# EAGLE design ECG (EAGLE 7.5.0)

## Sheet 1 of 2
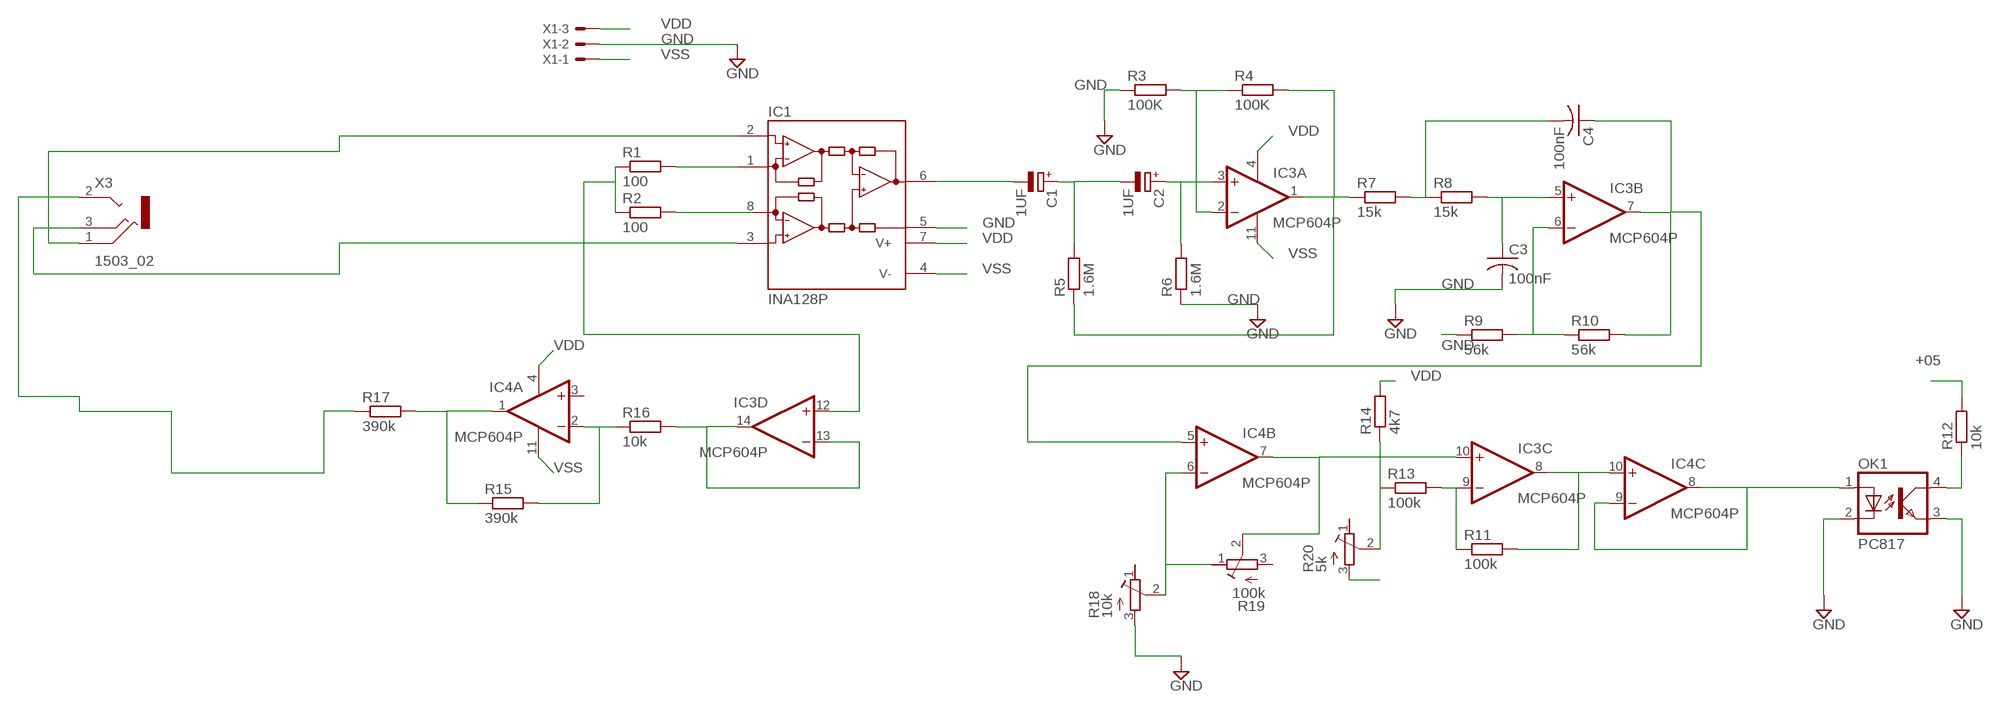
[diagram p0: schematic, sheet 1]

### Parts
C1  1UF  CPOL-EUE5-6  [E5-6]
C2  1UF  CPOL-EUE5-6  [E5-6]
C3  100nF  C-US050-030X075  [C050-030X075]
C4  100nF  C-US050-030X075  [C050-030X075]
IC1  INA128P  [DIL08]
IC3  MCP604P  [DIL14]
IC4  MCP604P  [DIL14]
OK1  PC817  [DIL04]
R1  100  R-EU_0207/10  [0207/10]
R2  100  R-EU_0207/10  [0207/10]
R3  100K  R-EU_0207/10  [0207/10]
R4  100K  R-EU_0207/10  [0207/10]
R5  1.6M  R-EU_0207/10  [0207/10]
R6  1.6M  R-EU_0207/10  [0207/10]
R7  15k  R-EU_0207/10  [0207/10]
R8  15k  R-EU_0207/10  [0207/10]
R9  56k  R-EU_0207/10  [0207/10]
R10  56k  R-EU_0207/10  [0207/10]
R11  100k  R-EU_0207/10  [0207/10]
R12  10k  R-EU_0207/10  [0207/10]
R13  100k  R-EU_0207/10  [0207/10]
R14  4k7  R-EU_0207/10  [0207/10]
R15  390k  R-EU_0207/10  [0207/10]
R16  10k  R-EU_0207/10  [0207/10]
R17  390k  R-EU_0207/10  [0207/10]
R18  10k  R-TRIMMT18  [RTRIMT18]
R19  100k  R-TRIMMT18  [RTRIMT18]
R20  5k  R-TRIMMT18  [RTRIMT18]
X1  KK-156-3  [KK-156-3]
X3  1503_02  [1503_02]

### Nets
+05: R12.2 ; also sheet 2
GND: C3.2 IC1.5(REF) OK1.2(C) OK1.3(EMIT) R3.1 R6.1 R9.1 R18.3(A) X1.2 ; also sheet 2
N$1: IC3.9(C:-IN) R11.1 R13.2
N$3: IC1.1(RG) R1.2
N$4: IC1.8(RG) R2.2
N$5: IC3.12(D:+IN) R1.1 R2.1
N$6: IC1.2(-IN) X3.1
N$7: IC3.13(D:-IN) IC3.14(D:OUT) R16.2
N$8: IC4.2(A:-IN) R15.2 R16.1
N$9: IC4.1(A:OUT) R15.1 R17.2
N$10: R17.1 X3.2
N$11: IC1.3(+IN) X3.3
N$12: C1.- IC1.6(OUT)
N$13: C1.+ C2.- R5.2
N$14: C2.+ IC3.3(A:+IN) R6.2
N$15: IC3.1(A:OUT) R4.2 R5.1 R7.1
N$16: C4.2 R7.2 R8.1
N$17: IC3.2(A:-IN) R3.2 R4.1
N$18: C3.1 IC3.5(B:+IN) R8.2
N$19: IC3.6(B:-IN) R9.2 R10.1
N$20: C4.1 IC3.7(B:OUT) IC4.5(B:+IN) R10.2
N$21: IC3.10(C:+IN) IC4.7(B:OUT) R19.2(S)
N$22: IC4.6(B:-IN) R18.2(S) R19.1(E)
N$23: R13.1 R14.1 R20.2(S)
N$24: IC3.8(C:OUT) IC4.10(C:+IN) R11.2
VDD: IC1.7(V+) IC3.4(P:V+) IC4.4(P:V+) R14.2 X1.3 ; also sheet 2
VECG: IC4.8(C:OUT) IC4.9(C:-IN) OK1.1(A) ; also sheet 2
VECG1: OK1.4(COL) R12.1 ; also sheet 2
VSS: IC1.4(V-) IC3.11(P:V-) IC4.11(P:V-) R20.3(A) X1.1
Unconnected: IC4.3(A:+IN) IC4.12(D:+IN) IC4.13(D:-IN) IC4.14(D:OUT) R18.1(E) R19.3(A) R20.1(E) X3.2@2

## Sheet 2 of 2
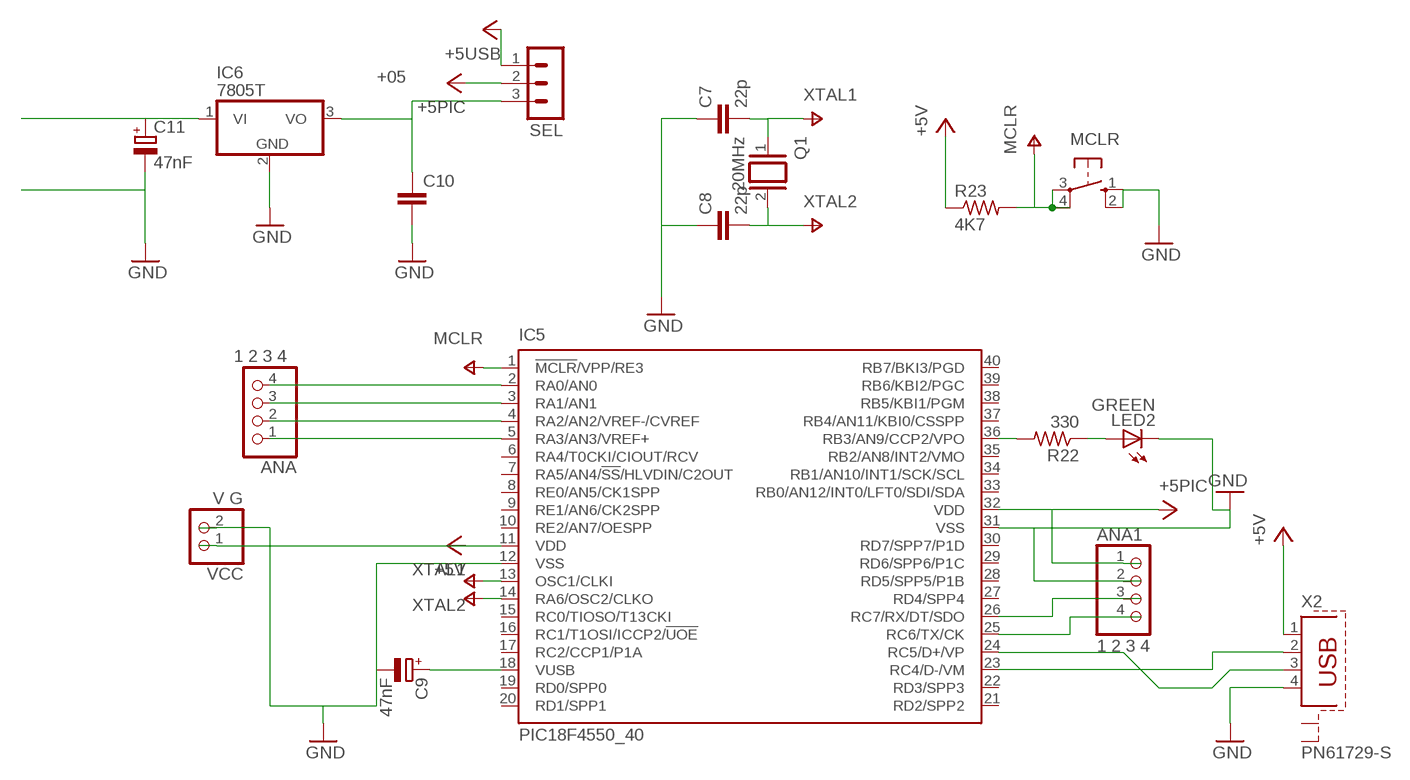
[diagram p1: schematic, sheet 2]

### Parts
ANA  1 2 3 4  PINHD-1X4  [1X04]
ANA1  1 2 3 4  PINHD-1X4  [1X04]
C7  22p  C-EU025-024X044  [C025-024X044]
C8  22p  C-EU025-024X044  [C025-024X044]
C9  47nF  CPOL-EUE2,5-6E  [E2,5-6E]
C10  C-EU050-035X075  [C050-035X075]
C11  47nF  CPOL-EUE2,5-6E  [E2,5-6E]
IC5  PIC18F4550_40  [DIL40]
IC6  7805T  [TO220H]
LED2  GREEN  TLLG4400  [LED3MM]
MCLR  10-XX  [B3F-10XX]
Q1  20MHz  XTAL/S  [QS]
R22  330  R-US_0207/10  [0207/10]
R23  4K7  R-US_0207/10  [0207/10]
SEL  MA03-1  [MA03-1]
VCC  V G  PINHD-1X2  [1X02]
X2  PN61729-S  [PN61729-S]

### Nets
+05: C10.1 IC6.3(VO) SEL.3 ; also sheet 1
+5PIC: ANA1.1 IC5.11(VDD) IC5.32(VDD) R23.1 SEL.2 VCC.1 ; supply symbol labelled +5V
+5USB: SEL.1 X2.1 ; supply symbol labelled +5V
GND: ANA1.2 C7.1 C8.1 C9.- C10.2 C11.- IC5.12(VSS) IC5.31(VSS) IC6.2(GND) LED2.K(C) MCLR.1(S) MCLR.2(S1) VCC.2 X2.4 ; also sheet 1
MCLR: IC5.1(!MCLR!/VPP/RE3) MCLR.3(P) MCLR.4(P1) R23.2
N$2: ANA1.3 IC5.26(RC7/RX/DT/SDO)
N$25: ANA1.4 IC5.25(RC6/TX/CK)
N$30: IC5.36(RB3/AN9/CCP2/VPO) R22.2
N$155: LED2.A R22.1
N$159: IC5.23(RC4/D-/VM) X2.2
N$168: IC5.24(RC5/D+/VP) X2.3
N$175: C9.+ IC5.18(VUSB)
N$180: ANA.2 IC5.4(RA2/AN2/VREF-/CVREF)
N$181: ANA.1 IC5.5(RA3/AN3/VREF+)
VDD: C11.+ IC6.1(VI) ; also sheet 1
VECG: ANA.4 IC5.2(RA0/AN0) ; also sheet 1
VECG1: ANA.3 IC5.3(RA1/AN1) ; also sheet 1
XTAL1: C7.2 IC5.13(OSC1/CLKI) Q1.1
XTAL2: C8.2 IC5.14(RA6/OSC2/CLKO) Q1.2
Unconnected: IC5.6(RA4/T0CKI/CIOUT/RCV) IC5.7(RA5/AN4/!SS!/HLVDIN/C2OUT) IC5.8(RE0/AN5/CK1SPP) IC5.9(RE1/AN6/CK2SPP) IC5.10(RE2/AN7/OESPP) IC5.15(RC0/TIOSO/T13CKI) IC5.16(RC1/T1OSI/ICCP2/!UOE) IC5.17(RC2/CCP1/P1A) IC5.19(RD0/SPP0) IC5.20(RD1/SPP1) IC5.21(RD2/SPP2) IC5.22(RD3/SPP3) IC5.27(RD4/SPP4) IC5.28(RD5/SPP5/P1B) IC5.29(RD6/SPP6/P1C) IC5.30(RD7/SPP7/P1D) IC5.33(RB0/AN12/INT0/LFT0/SDI/SDA) IC5.34(RB1/AN10/INT1/SCK/SCL) IC5.35(RB2/AN8/INT2/VMO) IC5.37(RB4/AN11/KBI0/CSSPP) IC5.38(RB5/KBI1/PGM) IC5.39(RB6/KBI2/PGC) IC5.40(RB7/BKI3/PGD) X2.S1 X2.S2

## Library data of the parts
ANA ANA1 = pinhead:PINHD-1X4: PIN HEADER
C1 C2 C9 C11 = resistor:CPOL-EU: POLARIZED CAPACITOR, European symbol
C3 C4 = resistor:C-US: CAPACITOR, American symbol
C7 C8 C10 = rcl:C-EU: CAPACITOR, European symbol
IC1 = burr-brown:INA128: Instrumentation Amplifiers Precision, Low Power; MF: TEXAS INSTRUMENTS; MPN: INA128P; OC_FARNELL: 1212410; OC_NEWARK: 74C9783
IC3 IC4 = linear:MCP604: Quad Op Amp 2.7V to 6.0V Single Supply CMOS Source: http://ww1.microchip.com/downloads/en/DeviceDoc/21314g.pdf
IC5 = microchip:PIC18F4*_40: USB Microcontrollers with nanoWatt Technology High-Performance, Enhanced Flash, 28/40/44-Pin, Source: http://ww1.microchip.com/downloads/en/devicedoc/39632c.pdf; MF: MICROCHIP; MPN: PIC18F4550-I/P; OC_FARNELL: 9321357; OC_NEWARK: 74K8623
IC6 = linear:78*: Positive VOLTAGE REGULATOR Source: http://cache.national.com/ds/LM/LM78L05.pdf http://www.fairchildsemi.com/ds/LM/LM7805.pdf
LED2 = led:TLLG4400: Low Current (2mA) LED 3 mm Tinted Diffused Package color GREEN Source: Data sheet <http://www.farnell.com/datasheets/391098.pdf>; MF: VISHAY SEMICONDUCTOR; OC_FARNELL: 1612435
MCLR = switch-omron:10-XX: OMRON SWITCH; MPN: B3F-1000; OC_FARNELL: 176432; OC_NEWARK: 36M3542
OK1 = optocoupler:PC817: SHARP OPTO COUPLER; MPN: PC817X4J000F; OC_FARNELL: 9707727; OC_NEWARK: 97K7059
Q1 = special:XTAL/S: CRYSTAL
R1-R17 = resistor:R-EU_: RESISTOR, European symbol
R18-R20 = rcl:R-TRIMM: Trimm resistor
R22 R23 = resistor:R-US_: RESISTOR, American symbol
SEL = con-lstb:MA03-1: PIN HEADER; OC_FARNELL: unknown; OC_NEWARK: unknown
VCC = pinhead:PINHD-1X2: PIN HEADER
X1 = con-molex:KK-156-3: KK 156 HEADER Source: http://www.molex.com/pdm_docs/sd/026604100_sd.pdf; OC_FARNELL: unknown; OC_NEWARK: unknown
X2 = con-berg:PN61729-S: BERG USB connector; OC_FARNELL: unknown; OC_NEWARK: unknown
X3 = con-lumberg:1503_02: Jack connectors according to JISC 6560, 3.5 mm Klinkeneinbaukupplung nach JISC 6560, 3,5 mm, 3-polig/stereo, abgewinkelte Ausführung, Surface-Mount-Technik (SMT) Source: http://www.lumberg.com/Produkte/PDFs/1503_02.pdf; OC_FARNELL: 1216979; OC_NEWARK: unknown

## Board
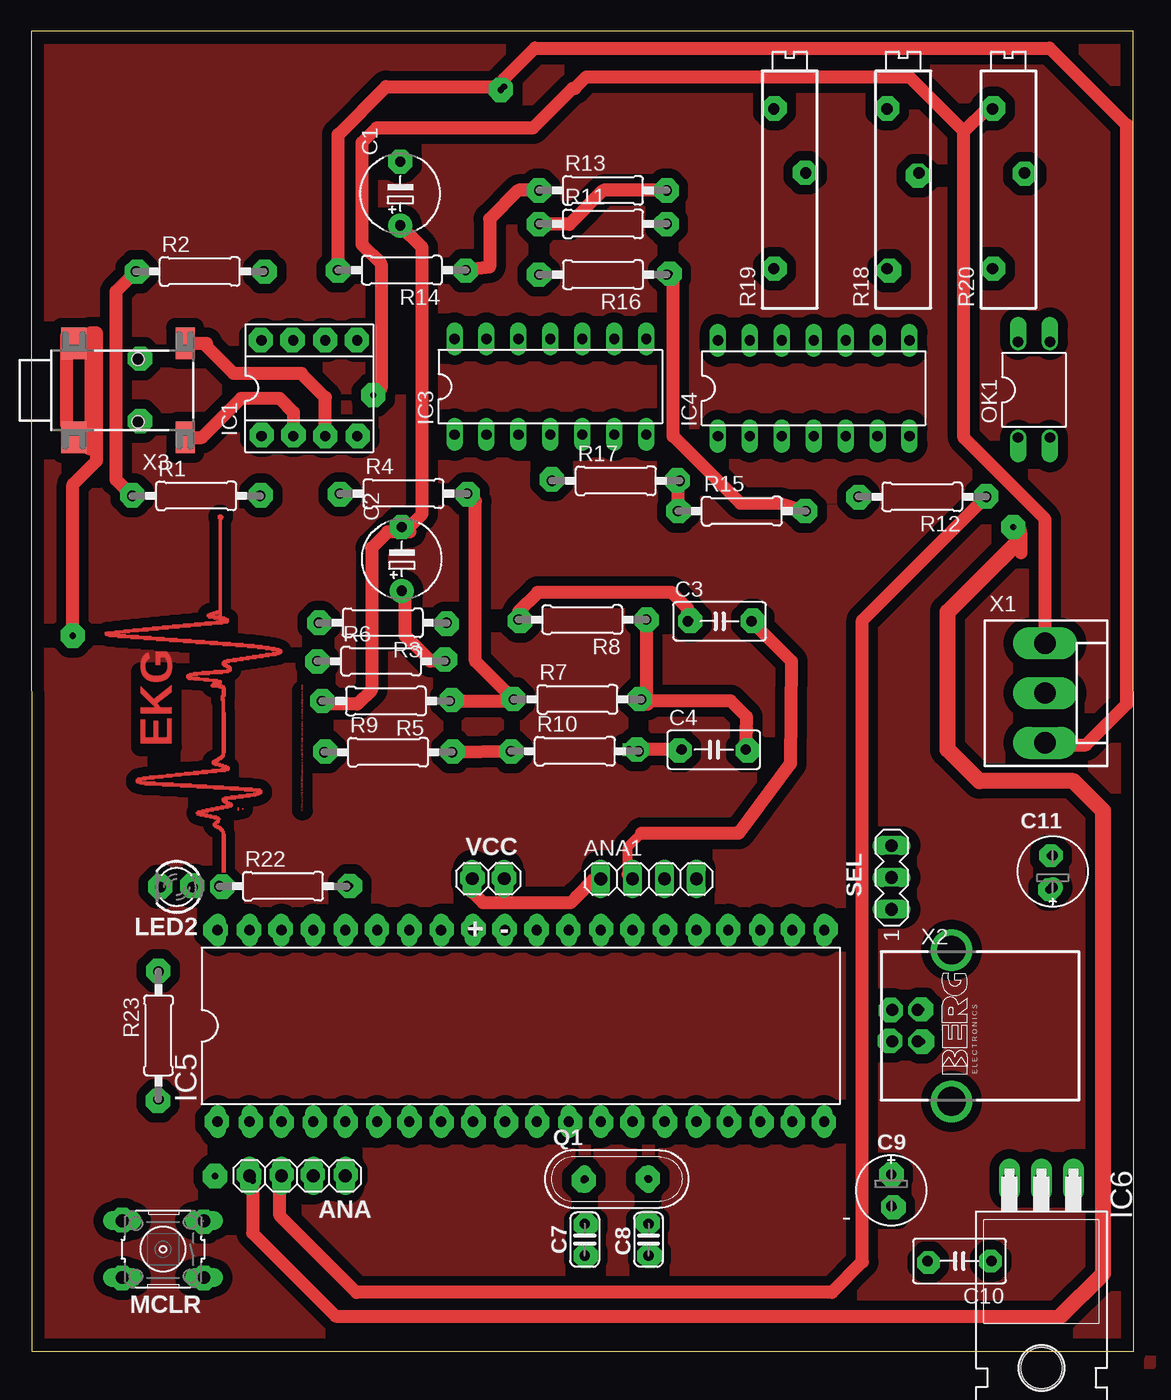
[diagram p2: board, top side]
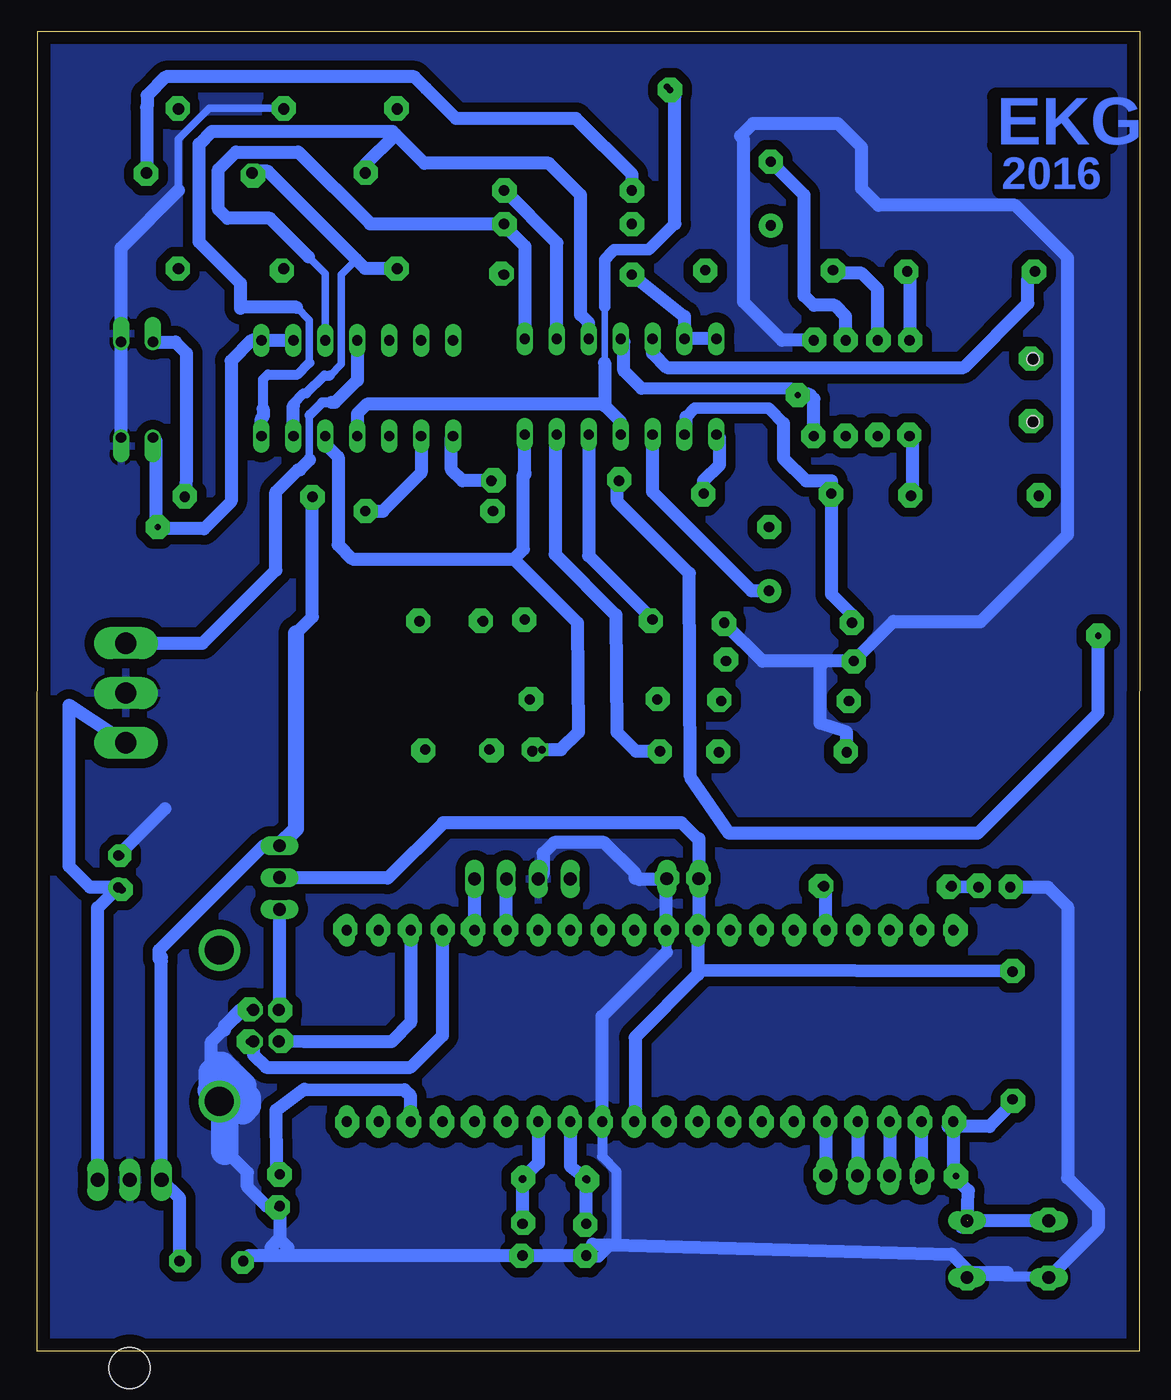
[diagram p3: board, bottom side, seen from below]

Size 87.69 x 105.05 mm. Coordinates in mm from the lower left corner, seen from the top.
Outline: 0.03,0 87.69,0 87.66,105.05 0,105.05 0.03,0
Copper layers (1*16): Top 0.035mm / dielectric 1.5mm / Bottom 0.035mm
Design rules "default *": minimum track width 10mil, minimum drill 24mil, track to track 30mil, track to pad 30mil, pad to pad 30mil, via to via 30mil, smd to smd 8mil, copper to edge 40mil, drill to drill 8mil, minimum pad ring 10mil, minimum via ring 8mil, stop-mask expansion 4mil, vias tented up to drill 0mil, thermal gap 10mil

### Footprints (pad centres in the part's own frame; a part is rotated, then mirrored left to right if it is on the bottom)
1X04 = drill 1.016 long: 1 -3.81,0; 2 -1.27,0; 3 1.27,0; 4 3.81,0
E5-6 = drill 0.813 pad 1.905: + -2.54,0 | drill 0.813 pad 1.905 octagon: - 2.54,0
C050-030X075 = drill 0.813 octagon: 1 -2.54,0; 2 2.54,0
C025-024X044 = drill 0.813 octagon: 1 -1.27,0; 2 1.27,0
E2,5-6E = drill 0.813 pad 1.575: + -1.27,0 | drill 0.813 pad 1.575 octagon: - 1.27,0
C050-035X075 = drill 0.813 octagon: 1 -2.54,0; 2 2.54,0
DIL08 = drill 0.813 pad 1.6 octagon: 1 -3.81,-3.81; 2 -1.27,-3.81; 3 1.27,-3.81; 4 3.81,-3.81; 5 3.81,3.81; 6 1.27,3.81; 7 -1.27,3.81; 8 -3.81,3.81
DIL14 = drill 0.813 long: 1 -7.62,-3.81; 2 -5.08,-3.81; 3 -2.54,-3.81; 4 0,-3.81; 5 2.54,-3.81; 6 5.08,-3.81; 7 7.62,-3.81; 8 7.62,3.81; 9 5.08,3.81; 10 2.54,3.81; 11 0,3.81; 12 -2.54,3.81; 13 -5.08,3.81; 14 -7.62,3.81
DIL40 = drill 0.813 long: 1 -24.13,-7.62; 2 -21.59,-7.62; 3 -19.05,-7.62; 4 -16.51,-7.62; 5 -13.97,-7.62; 6 -11.43,-7.62; 7 -8.89,-7.62; 8 -6.35,-7.62; 9 -3.81,-7.62; 10 -1.27,-7.62; 11 1.27,-7.62; 12 3.81,-7.62; 13 6.35,-7.62; 14 8.89,-7.62; 15 11.43,-7.62; 16 13.97,-7.62; 17 16.51,-7.62; 18 19.05,-7.62; 19 21.59,-7.62; 20 24.13,-7.62; 21 24.13,7.62; 22 21.59,7.62; 23 19.05,7.62; 24 16.51,7.62; 25 13.97,7.62; 26 11.43,7.62; 27 8.89,7.62; 28 6.35,7.62; 29 3.81,7.62; 30 1.27,7.62; 31 -1.27,7.62; 32 -3.81,7.62; 33 -6.35,7.62; 34 -8.89,7.62; 35 -11.43,7.62; 36 -13.97,7.62; 37 -16.51,7.62; 38 -19.05,7.62; 39 -21.59,7.62; 40 -24.13,7.62
TO220H = drill 1.118 long: 1 -2.54,-10.16; 2 0,-10.16; 3 2.54,-10.16 | hole 3.302: 0,4.826
LED3MM = drill 0.813 octagon: A -1.27,0; K 1.27,0
B3F-10XX = drill 1.016 long: 1 -3.251,2.261; 2 3.251,2.261; 3 -3.251,-2.261; 4 3.251,-2.261
DIL04 = drill 0.813 offset: 1 -1.27,-3.81; 2 1.27,-3.81; 3 1.27,3.81; 4 -1.27,3.81
QS = drill 0.61 long: 1 -2.54,0; 2 2.54,0
0207/10 = drill 0.813 octagon: 1 -5.08,0; 2 5.08,0
RTRIMT18 = drill 0.9: 1 -7.62,1.27; 2 0,-1.27; 3 5.08,1.27
MA03-1 = drill 1.016 long: 1 -2.54,0; 2 0,0; 3 2.54,0
1X02 = drill 1.016 long: 1 -1.27,0; 2 1.27,0
KK-156-3 = drill 1.7 pad 2.184 long: 1 -3.96,0; 2 0,0; 3 3.96,0
PN61729-S = drill 0.95 octagon: 1 1.25,4.71; 2 -1.25,4.71; 3 -1.25,2.71; 4 1.25,2.71 | drill 2.3 pad 2.9: S1 -6.02,0; S2 6.02,0
1503_02 = smd 2.5 x 1.5: 1 -3.75,-10.75; 3 3.75,-10.75 | smd 2.5 x 2: 2 -3.75,-1.9; 2@2 3.75,-1.9 | hole 1: -2.5,-7; 2.5,-7

### Placement (x,y rotation side)
ANA  21.16,13.97 180 top
ANA1  49.1,37.59 0 top
C1  29.35,92.15 90 top
C2  29.47,63.06 90 top
C3  54.75,58.11 0 top
C4  54.29,47.89 0 top
C7  44.02,8.89 90 top
C8  49.1,8.89 90 top
C9  68.4,12.83 270 top
C10  73.84,7.19 180 top
C11  81.26,38.2 90 top
IC1  22.11,76.65 0 top
IC3  41.29,76.78 0 top
IC4  62.24,76.65 0 top
IC5  38.94,25.91 0 top
IC6  80.36,3.49 180 top
LED2  11.55,36.95 180 top
MCLR  10.47,8.13 180 top
OK1  79.77,76.53 0 top
Q1  46.56,13.72 0 top
R1  13.11,68.09 0 top
R2  13.39,85.94 0 top
R3  27.95,57.98 180 top
R4  29.6,68.27 0 top
R5  28.2,51.76 180 top
R6  27.82,54.94 0 top
R7  43.44,51.89 0 top
R8  43.83,58.24 180 top
R9  28.38,47.69 0 top
R10  43.24,47.76 0 top
R11  45.48,89.73 0 top
R12  70.88,68.02 180 top
R13  45.48,92.4 0 top
R14  29.47,86.05 180 top
R15  56.53,66.87 0 top
R16  45.48,85.69 180 top
R17  46.49,69.29 0 top
R18  69.35,93.8 90 top
R19  60.34,93.8 90 top
R20  77.73,93.8 90 top
R22  20.02,37.01 0 top
R23  10.11,25.15 270 top
SEL  68.43,37.71 90 top
VCC  36.34,37.62 0 top
X1  80.66,52.4 270 top
X2  73.21,25.91 90 top
X3  1.48,76.48 90 top

### Tracks (layer width: path | path; a pad name or v marks a point on that pad's centre or on a via)
+05  (via drill 0.5 pad 1.93)
  Bottom 1.016: 77.82,31.05 IC6.3 76.38,12.22 C10.1 | 77.82,31.05 77.82,31.36 | 67.09,57.16 65.81,58.45 v65.81,67.98 65.81,68 R12.2 | SEL.3 69.68,40.25 78.01,31.91 78.01,31.25 77.82,31.05
  Bottom 1.27: SEL.3 67.09,41.59 67.09,57.16
+5PIC
  Top 1.016: ANA1.1 44.79,37.59 43.37,36.17 | 43.37,36.17 | 43.37,36.17 42.9,35.7 35.93,35.7 35.07,36.56 VCC.1
  Bottom 1.016: 35.13,30.42 IC5.32 35.07,33.59 VCC.1 35.05,37.63 35.05,40.79 35.16,40.79 36.44,42.07 55.41,42.07 59.82,37.66 68.38,37.66 SEL.2 | 35.13,30.42 35.13,30 40.14,24.99 40.14,18.36 IC5.11 | R23.1 35.02,30.3 35.13,30.42
+5USB
  Bottom 1.016: SEL.1 68.43,27.22 X2.1
GND
  Top 0.813: 47.45,37.97 47.45,40.14 48.52,41.22
  Top 1.016: 47.45,37.97 ANA1.2 | C3.2 60.46,54.94 60.38,46.75 56.27,41.22 48.52,41.22
  Bottom 0.61: 76.46,92.4 76.46,96.46 74,98.92 68.13,98.92 R18.3
  Bottom 0.813: IC5.12 42.75,15.5 41.63,14.38 41.63,8.84 43.02,7.45 43.85,7.45 C7.1 | 37.63,31.79 37.63,33.49 IC5.31 | 10.79,5.99 10.42,6.35 13.5,6.35 13.87,5.99 13.6,5.99 | 10.79,5.99 13.21,5.99 13.6,5.99 | 13.6,5.99 MCLR.1 | 10.79,5.99 7.34,5.99 MCLR.2
  Bottom 1.016: X2.4 71.55,27.16 | 71.55,27.16 72.8,25.91 | 68.7,7.62 C8.1 C7.1 43.51,8.52 14.95,7.73 13.21,5.99 | 68.7,7.62 70.87,7.62 C10.2 | 68.35,8.87 68.4,8.91 C9.- 69.45,11.56 70.98,13.09 70.98,14.24 72.62,15.88 72.7,15.88 | 67.74,8.25 68.35,8.87 | 68.35,8.87 68.51,8.87 69.12,8.25 69.12,8.04 68.7,7.62 | 71.55,27.16 71.55,27.08 72.77,25.86 | 73.84,20.79 73.84,24.64 72.81,25.67 | 72.81,25.67 72.81,25.74 71.36,27.19 | 72.81,25.55 72.81,25.67 | 71.36,27.19 71.17,27.38 70.79,27.38 70.6,27.19 71.36,27.19 | 72.7,15.88 72.77,15.88 72.89,15.99 72.81,15.99 72.7,15.88 | IC5.31 37.67,37.56 | 37.67,37.56 VCC.2 | 77.55,43.18 C11.- | IC1.5 28.46,80.46 31.51,83.51 31.51,96.46 31.76,96.72 30.74,97.73 24.01,97.73 22.11,95.83 22.11,92.55 20.77,91.21 9.9,91.21 5.72,87.03 5.72,64.99 12.66,58.06 19.62,58.06 | 19.57,58.11 19.62,58.06 | 19.62,58.06 R6.1 25.03,54.94 | 25.03,54.94 29.98,54.94 R3.1 | R9.1 23.3,49.29 25.41,49.98 25.41,54.55 25.03,54.94 | OK1.2 OK1.3 81.04,87.83 76.46,92.4 | IC5.12 42.75,26.67 37.63,31.79 | LED2.K 7.3,36.95 5.73,35.38 5.73,13.8 3.29,11.36 3.29,9.8 MCLR.2 | 37.67,37.56 39.8,37.56 39.9,37.66 40.14,37.66 40.14,38.06 42.58,40.5 46.58,40.5 47.45,39.63 47.45,37.97 ANA1.2
  Bottom 2.184: 72.77,15.93 72.77,20.41 71.74,21.44 71.74,20.94 70.98,20.18 70.98,19.53 71.36,19.15 71.36,21.13 73,22.77 73.19,22.77 73.76,22.2 73.76,20.87 73.84,20.79
  pour Bottom: -0.53,105.32 -0.61,-0.8 89.27,-0.77 89.35,105.34
MCLR  (1 unrouted)
  Bottom 1.016: 14.81,17.74 IC5.1 14.56,18.03 | 14.81,17.74 14.81,13.97 13.62,12.78 MCLR.3 | MCLR.4 13.66,10.39 14.17,9.88 | R23.2 10.11,19.74 11.95,17.9 14.97,17.9 | 15.26,17.9 14.97,17.9 | 14.97,17.9 14.81,17.74
N$1
  Top 1.016: R13.2 45.51,92.4 42.82,89.71 40.42,89.71 R11.1
  Bottom 1.016: IC3.9 46.36,88.21 R13.2
N$2
  Bottom 1.016: IC5.26 ANA1.3
N$3
  Bottom 1.016: IC1.1 18.42,72.72 18.32,72.72 18.09,72.94 18.09,68.18 R1.2
N$4
  Bottom 1.016: R2.2 18.3,85.69 IC1.8
N$5
  Top 1.016: R2.1 6.74,84.37 6.74,69.38 R1.1
  Bottom 1.016: IC3.12 38.74,79.45 37.6,78.3 13.99,78.3 8.88,83.41 8.88,85.38 R2.1
N$6
  Top 1.016: X3.1 13.55,72.73 16.67,75.85 19.75,75.85 20.85,74.75 20.85,72.85 IC1.2
N$7
  Bottom 1.016: IC3.13 36.2,81.48 | IC3.14 IC3.13 | R16.2 36.2,82.37 IC3.13
N$8
  Top 1.016: R15.2 59.57,67.51 56.4,67.51 51.06,72.84 51.06,85.04 50.57,85.61 R16.1
  Bottom 1.016: IC4.2 57.16,69.92 60.21,66.87 R15.2
N$9
  Top 1.016: R15.1 51.44,69.03 R17.2
  Bottom 1.016: R17.2 53.86,69.29 54.75,70.17 54.75,72.72 IC4.1
N$10  (via drill 0.5 pad 1.93)
  Top 1.016: 3.29,72.64 X3.2 3.38,73.09 | v3.29,56.95 3.29,69 5.18,70.89 5.18,81.05 4.71,81.05 4.71,71.92 4.79,71.84 4.63,71.84 3.38,73.09 | 4.47,80.89 2.82,80.89 2.82,73.65 3.29,73.17 3.38,73.09
  Bottom 1.016: R17.1 41.54,69.16 41.54,67.64 35.82,61.92 35.75,45.73 32.65,41.22 12.88,41.22 3.29,50.81 v3.29,56.95
N$11
  Top 1.016: X3.3 13.68,80.23 | 13.68,80.23 13.95,80.23 | IC1.3 23.38,75.92 21.48,77.82 16.09,77.82 13.68,80.23
N$12
  Bottom 1.016: IC1.6 23.38,82.37 24.27,83.26 25.92,83.26 26.68,84.02 26.68,92.02 C1.-
N$13
  Top 1.016: 30.11,65.22 29.85,65.22 | 29.85,65.22 C2.- 30.05,65.6 31.08,66.64 31.08,87.87 C1.+ | 29.85,65.22 28.33,65.22 27.06,63.95 27.06,52.65 25.92,51.51 23.38,51.51 R5.2
N$14
  Top 1.016: R6.2 31.76,54.94 29.73,56.97 29.73,60.27 C2.+
  Bottom 1.016: 38.62,72.84 IC3.3 38.74,68.4 30.87,60.52 C2.+
N$15
  Top 1.016: R5.1 38.24,51.76 R7.1 35.32,54.94 35.32,67.64 R4.2
  Bottom 1.016: R4.2 34.68,69.29 33.41,70.56 33.41,72.72 IC3.1
N$16
  Top 1.016: 56.91,49.6 C4.2 56.91,50.49 55.64,51.76 49.29,51.76 49.03,51.51 48.9,51.51 | 48.9,51.51 R7.2 | R8.1 48.9,51.51
N$17
  Bottom 0.914: 28.33,73.86 28.33,73.89 29.43,74.99 | 29.43,74.99 | 29.43,74.99 29.51,75.06 35.38,75.06 36.08,74.37
  Bottom 1.016: IC3.2 36.08,72.84 36.08,74.37 | R3.2 22.87,58.62 24.52,60.27 R4.1 24.52,69.29 26.55,69.29 28.33,71.06 28.33,73.86
N$18
  Top 1.016: C3.1 52.21,59.13 50.94,60.4 40.27,60.4 38.74,58.87 R8.2 38.74,57.73
  Bottom 1.016: IC3.5 43.82,63.32 R8.2
N$19
  Top 1.016: R9.2 R10.1
  Bottom 1.016: IC3.6 46.49,72.84 46.49,63.44 41.67,58.62 41.59,49.29 40.06,47.77 R10.1
N$20  (via drill 0.6)
  Top 1.016: C4.1 v47.56,47.89 R10.2
  Bottom 1.016: 48.9,69.79 48.9,69.92 | 48.9,69.92 IC3.7 | 49.79,63.06 62.62,63.06 63.76,64.21 63.76,71.19 64.78,72.21 IC4.5 | 49.79,63.06 49.03,63.83 49.03,69.79 48.9,69.92 | v47.56,47.89 46.03,47.89 44.64,49.29 44.71,57.98 49.79,63.06
N$21
  Bottom 0.61: 66.05,78.68 66.05,82.08 67.07,83.1
  Bottom 0.813: 69.73,75 69.73,77.36 69.35,77.74 66.99,77.74 66.05,78.68
  Bottom 1.016: IC4.7 69.86,74.24 69.73,74.37 69.73,75 | IC3.10 43.82,81.86 44.46,82.49 44.46,92.02 47,94.56 56.91,94.56 59.19,96.84 | 59.19,96.84 59.45,97.1 73.8,97.1 74.81,96.08 74.81,88.29 71.51,84.99 71.51,83.25 | R19.2 61.6,94.43 59.19,96.84 | 71.51,83 71.51,83.25 | 67.07,83.1 71.35,83.1 71.51,83.25
N$22
  Bottom 0.61: 62.32,86.9 63.51,85.71 63.51,78.56 64.4,77.66
  Bottom 0.813: 67.32,75.25 67.32,75.44 66.52,76.25 66.28,76.25 64.86,77.66 64.4,77.66
  Bottom 1.016: IC4.6 67.32,75.25 | R18.2 70.49,93.92 69.35,93.92 62.32,86.9 61.6,86.18 R19.1
N$23
  Top 1.016: R13.1 38.74,92.4 36.46,90.11 36.46,86.3 R14.1
  Bottom 1.016: R13.1 40.4,93.67 44.84,98.11 54.37,98.11 56.78,100.53 57.7,101.44 77.46,101.44 78.96,99.95 78.96,99.05 79,99 R20.2
N$24
  Bottom 0.61: IC4.10 64.78,85.77 66.12,87.11
  Bottom 1.016: IC3.8 48.9,87.95 50.56,89.61 R11.2 61.22,89.73 66.94,95.45 71.89,95.45 73.29,94.05 73.29,90.89 72.58,90.18 69.19,90.18 66.12,87.11
N$25
  Bottom 1.016: IC5.25 ANA1.4
N$26  (via drill 0.5 pad 1.93)
  other vias: 37.35,100.4
N$28  (via drill 0.5 pad 1.93)
  other vias: 78.12,65.6
N$29
  pour Top: -0.64,105.63 -0.86,-1.21 88.99,-1 88.83,105.62
N$30
  Bottom 1.016: IC5.36 24.97,36.89 R22.2
N$31  (via drill 0.5 pad 1.93)
  other vias: 22.9,57.98
N$32  (via drill 0.5 pad 1.93)
  other vias: 25.34,37.03
N$33  (via drill 0.5 pad 1.93)
  other vias: 22.74,54.91
N$34  (via drill 0.5 pad 1.93)
  other vias: 23.13,51.76
N$35  (via drill 0.5 pad 1.93)
  other vias: 33.05,57.9
N$36  (via drill 0.5 pad 1.93)
  other vias: 32.9,55.06
N$37  (via drill 0.5 pad 1.93)
  other vias: 33.45,51.84
N$38  (via drill 0.5 pad 1.93)
  other vias: 38.33,51.92
N$39  (via drill 0.5 pad 1.93)
  other vias: 33.53,47.74
N$40  (via drill 0.5 pad 1.93)
  other vias: 38.17,47.74
N$41  (via drill 0.5 pad 1.93)
  other vias: 23.37,47.74
N$42  (via drill 0.5 pad 1.93)
  other vias: 38.88,58.14
N$43  (via drill 0.5 pad 1.93)
  other vias: 48.96,58.21
N$44  (via drill 0.5 pad 1.93)
  other vias: 48.41,51.92
N$45  (via drill 0.5 pad 1.93)
  other vias: 48.17,47.9
N$46  (via drill 0.5 pad 1.93)
  other vias: 51.56,47.82
N$47  (via drill 0.5 pad 1.93)
  other vias: 56.99,47.82
N$48  (via drill 0.5 pad 1.93)
  other vias: 57.38,58.14
N$49  (via drill 0.5 pad 1.93)
  other vias: 52.42,58.14
N$50  (via drill 0.5 pad 1.93)
  other vias: 41.4,69.4
N$51  (via drill 0.5 pad 1.93)
  other vias: 51.4,69.32
N$52  (via drill 0.5 pad 1.93)
  other vias: 51.48,66.88
N$53  (via drill 0.5 pad 1.93)
  other vias: 61.56,66.88
N$54  (via drill 0.5 pad 1.93)
  other vias: 75.97,68.06
N$55  (via drill 0.5 pad 1.93)
  other vias: 18.25,80.5
N$56  (via drill 0.5 pad 1.93)
  other vias: 20.77,80.5
N$57  (via drill 0.5 pad 1.93)
  other vias: 23.37,80.5
N$58  (via drill 0.5 pad 1.93)
  other vias: 25.89,80.5
N$59  (via drill 0.5 pad 1.93)
  other vias: 18.33,72.94
N$60  (via drill 0.5 pad 1.93)
  other vias: 20.85,72.94
N$61  (via drill 0.5 pad 1.93)
  other vias: 23.37,72.86
N$62  (via drill 0.5 pad 1.93)
  other vias: 25.97,72.86
N$63  (via drill 0.5 pad 1.93)
  other vias: 8.41,85.93
N$64  (via drill 0.5 pad 1.93)
  other vias: 18.56,85.93
N$65  (via drill 0.5 pad 1.93)
  other vias: 8.01,68.14
N$66  (via drill 0.5 pad 1.93)
  other vias: 18.25,68.14
N$67  (via drill 0.5 pad 1.93)
  other vias: 24.55,68.21
N$68  (via drill 0.5 pad 1.93)
  other vias: 34.71,68.21
N$69  (via drill 0.5 pad 1.93)
  other vias: 24.39,86.01
N$70  (via drill 0.5 pad 1.93)
  other vias: 34.55,86.01
N$71  (via drill 0.5 pad 1.93)
  other vias: 40.38,92.39
N$72  (via drill 0.5 pad 1.93)
  other vias: 40.38,89.71
N$73  (via drill 0.5 pad 1.93)
  other vias: 40.38,85.69
N$74  (via drill 0.5 pad 1.93)
  other vias: 50.77,85.77
N$75  (via drill 0.5 pad 1.93)
  other vias: 50.53,89.71
N$76  (via drill 0.5 pad 1.93)
  other vias: 50.53,92.39
N$77  (via drill 0.5 pad 1.93)
  other vias: 59.12,98.92
N$78  (via drill 0.5 pad 1.93)
  other vias: 61.56,93.8
N$79  (via drill 0.5 pad 1.93)
  other vias: 59.12,86.17
N$80  (via drill 0.5 pad 1.93)
  other vias: 68.09,98.92
N$81  (via drill 0.5 pad 1.93)
  other vias: 70.53,93.57
N$82  (via drill 0.5 pad 1.93)
  other vias: 68.25,86.01
N$83  (via drill 0.5 pad 1.93)
  other vias: 76.52,86.17
N$87  (via drill 0.5 pad 1.93)
  other vias: 79.04,93.73
N$88  (via drill 0.5 pad 1.93)
  other vias: 76.52,98.92
N$89  (via drill 0.5 pad 1.93)
  other vias: 8.64,79
N$90  (via drill 0.5 pad 1.93)
  other vias: 8.64,74.04
N$155
  Bottom 1.016: R22.1 LED2.A
N$159
  Bottom 1.016: IC5.23 57.99,26.16 59.51,24.64 66.47,24.64 X2.2
N$168
  Bottom 1.016: IC5.24 55.45,25.15 57.99,22.61 69.5,22.61 70.5,23.6 X2.3
N$175
  Bottom 1.016: IC5.18 57.99,20.32 58.5,20.83 66.45,20.87 68.7,19.19 68.66,14.73 68.4,14.48 C9.+
N$180
  Bottom 1.016: IC5.4 ANA.2
N$181
  Bottom 1.016: IC5.5 ANA.1
N$189  (via drill 0.5 pad 1.93)
  other vias: 14.64,33.53
N$190  (via drill 0.5 pad 1.93)
  other vias: 17.3,33.53
N$191  (via drill 0.5 pad 1.93)
  other vias: 19.82,33.63
N$192  (via drill 0.5 pad 1.93)
  other vias: 68.37,27.15
N$193  (via drill 0.5 pad 1.93)
  other vias: 70.8,27.22
N$194  (via drill 0.5 pad 1.93)
  other vias: 68.3,24.7
N$195  (via drill 0.5 pad 1.93)
  other vias: 70.85,24.65
N$196  (via drill 0.5 pad 1.93)
  other vias: 22.38,33.63
N$197  (via drill 0.5 pad 1.93)
  other vias: 25,33.63
N$198  (via drill 0.5 pad 1.93)
  other vias: 27.47,33.63
N$199  (via drill 0.5 pad 1.93)
  other vias: 30.08,33.63
N$200  (via drill 0.5 pad 1.93)
  other vias: 32.65,33.58
N$201  (via drill 0.5 pad 1.93)
  other vias: 35.17,33.63
N$202  (via drill 0.5 pad 1.93)
  other vias: 37.63,33.63
N$203  (via drill 0.5 pad 1.93)
  other vias: 40.19,33.58
N$204  (via drill 0.5 pad 1.93)
  other vias: 42.71,33.58
N$205  (via drill 0.5 pad 1.93)
  other vias: 45.33,33.63
N$206  (via drill 0.5 pad 1.93)
  other vias: 47.79,33.63
N$207  (via drill 0.5 pad 1.93)
  other vias: 50.41,33.63
N$208  (via drill 0.5 pad 1.93)
  other vias: 53.03,33.63
N$209  (via drill 0.5 pad 1.93)
  other vias: 55.44,33.63
N$210  (via drill 0.5 pad 1.93)
  other vias: 58.06,33.63
N$211  (via drill 0.5 pad 1.93)
  other vias: 60.58,33.63
N$212  (via drill 0.5 pad 1.93)
  other vias: 63.19,33.63
N$228  (via drill 0.5 pad 1.93)
  other vias: 17.3,14.08
N$229  (via drill 0.5 pad 1.93)
  other vias: 19.92,14.08
N$230  (via drill 0.5 pad 1.93)
  other vias: 22.38,14.08
N$231  (via drill 0.5 pad 1.93)
  other vias: 25,14.08
N$237  (via drill 0.5 pad 1.93)
  other vias: 43.94,13.61
N$238  (via drill 0.5 pad 1.93)
  other vias: 49.03,13.77
N$239  (via drill 0.5 pad 1.93)
  other vias: 44.1,10.07
N$240  (via drill 0.5 pad 1.93)
  other vias: 44.1,7.61
N$241  (via drill 0.5 pad 1.93)
  other vias: 49.18,7.61
N$242  (via drill 0.5 pad 1.93)
  other vias: 49.03,10.23
N$247  (via drill 0.5 pad 1.93)
  other vias: 68.43,14.08
N$248  (via drill 0.5 pad 1.93)
  other vias: 68.58,11.46
N$250  (via drill 0.5 pad 1.93)
  other vias: 10.25,36.98
N$251  (via drill 0.5 pad 1.93)
  other vias: 12.8,37.06
N$252  (via drill 0.5 pad 1.93)
  other vias: 15.18,36.98
N$254  (via drill 0.5 pad 1.93)
  other vias: 10.1,30.28
N$255  (via drill 0.5 pad 1.93)
  other vias: 7.24,10.46
N$256  (via drill 0.5 pad 1.93)
  other vias: 7.24,5.84
N$257  (via drill 0.5 pad 1.93)
  other vias: 13.71,5.84
N$258  (via drill 0.5 pad 1.93)
  other vias: 13.71,10.3
N$261  (via drill 0.5 pad 1.93)
  other vias: 14.61,13.94
N$262  (via drill 0.5 pad 1.93)
  other vias: 10.07,19.93
N$263  (via drill 0.5 pad 1.93)
  other vias: 14.74,18.29
N$264  (via drill 0.5 pad 1.93)
  other vias: 17.46,18.23
N$265  (via drill 0.5 pad 1.93)
  other vias: 19.92,18.23
N$266  (via drill 0.5 pad 1.93)
  other vias: 22.54,18.23
N$267  (via drill 0.5 pad 1.93)
  other vias: 25,18.23
N$268  (via drill 0.5 pad 1.93)
  other vias: 27.62,18.23
N$269  (via drill 0.5 pad 1.93)
  other vias: 30.08,18.23
N$270  (via drill 0.5 pad 1.93)
  other vias: 32.65,18.23
N$271  (via drill 0.5 pad 1.93)
  other vias: 35.17,18.23
N$272  (via drill 0.5 pad 1.93)
  other vias: 37.78,18.23
N$273  (via drill 0.5 pad 1.93)
  other vias: 40.25,18.23
N$274  (via drill 0.5 pad 1.93)
  other vias: 42.87,18.23
N$275  (via drill 0.5 pad 1.93)
  other vias: 45.33,18.23
N$276  (via drill 0.5 pad 1.93)
  other vias: 47.79,18.23
N$277  (via drill 0.5 pad 1.93)
  other vias: 50.41,18.23
N$278  (via drill 0.5 pad 1.93)
  other vias: 53.03,18.23
N$279  (via drill 0.5 pad 1.93)
  other vias: 55.49,18.23
N$280  (via drill 0.5 pad 1.93)
  other vias: 58.11,18.23
N$281  (via drill 0.5 pad 1.93)
  other vias: 60.58,18.23
N$282  (via drill 0.5 pad 1.93)
  other vias: 63.04,18.23
N$283  (via drill 1.1 pad 1.78)
  other vias: 73.19,31.92
N$284  (via drill 1.1 pad 1.78)
  other vias: 73.19,19.92
N$285  (via drill 0.5 pad 1.93)
  other vias: 35.09,37.67
N$286  (via drill 0.5 pad 1.93)
  other vias: 37.59,37.67
N$287  (via drill 0.6 pad 1.78)
  other vias: 80.98,36.74
N$288  (via drill 0.6 pad 1.78)
  other vias: 81.09,39.46
N$289  (via drill 0.6 pad 1.78)
  other vias: 76.32,7.19
N$290  (via drill 0.6 pad 1.78)
  other vias: 71.36,7.07
VDD  (via drill 0.5 pad 1.27)
  Top 1.016: R14.2 24.39,96.84 28.2,100.66 v37.6,100.66 37.6,101.27 40.06,103.73 81.01,103.73 87.15,97.59 87.15,51.52 83.89,48.27 80.82,48.27 X1.3
  Bottom 0.508: 42.55,78.68 42.55,83.13
  Bottom 0.914: 42.55,83.13 42.55,86.9 41.95,87.51 | 41.95,87.51 | 41.95,87.51 41.79,87.66 39.04,87.66 36.97,89.73
  Bottom 1.016: IC6.1 82.9,35.29 C11.+ 83.49,36.93 85.17,38.61 85.17,51.44 81.42,48.97 81.19,48.97 X1.3 | IC1.7 20.84,84.53 22.11,85.8 24.14,85.8 R14.2 | IC3.4 41.28,73.98 42.55,75.25 | 42.55,75.25 42.68,75.38 61.48,75.38 62.24,74.62 IC4.4 | 36.97,89.73 36.97,99.89 37.73,100.66 v37.6,100.66 | 42.55,78.68 42.55,75.25
VECG  (via drill 0.5 pad 1.27)  (1 unrouted)
  Top 1.016: v17.6,13.59 17.6,9.4 24.21,2.79 81.87,2.79 | 78.75,63.57 78.75,65.09 78.51,65.33 78.24,65.6
  Top 1.27: 81.87,2.79 85.26,6.19 85.26,43.02 82.9,45.38 75.41,45.38 72.9,47.9 72.9,58.84 78.51,64.46 78.51,65.33
  Bottom 1.016: ANA.4 IC5.2 17.35,13.84 v17.6,13.59 | IC4.9 IC4.8 70.62,80.46 72.27,78.81 72.27,67.64 74.43,65.48 78.11,65.48 78.24,65.6 78.24,72.46 OK1.1
VECG1
  Top 1.016: ANA.3 19.76,13.84 19.76,10.79 25.86,4.7 63.71,4.7 66.12,7.11 66.12,58.18 R12.1
  Bottom 1.016: IC5.3 ANA.3 | OK1.4 76.72,80.33 75.83,79.45 75.83,69.41 R12.1
VSS  (via drill 0.5 pad 1.93)
  Top 1.016: X1.1 80.65,66.24 74.18,72.72 74.18,97.1 | v27.19,76.1 27.82,76.65 27.82,86.56 26.3,88.08 26.3,96.21 27.44,97.35 39.89,97.35 43.06,100.53 43.24,100.53 44.16,101.44 69.83,101.44 74.18,97.1 | R20.3 75.96,98.88 74.18,97.1
  Bottom 0.61: 66.05,70.94 66.05,74.49 66.05,74.62
  Bottom 0.813: 64.27,75.51 65.03,75.51 66.05,74.49
  Bottom 0.965: 39.63,76.65 27.74,76.65 v27.19,76.1
  Bottom 1.016: IC1.4 25.92,75.8 26.28,76.17 27.12,76.17 v27.19,76.1 | 41.28,79.83 IC3.11 41.03,80.33 41.03,78.05 39.63,76.65 | 66.05,70.94 66.81,70.17 66.94,70.17 68.72,68.4 68.72,62.17 74.54,56.35 X1.1 | IC4.11 62.24,77.29 64.02,75.51 64.27,75.51
XTAL1
  Bottom 1.016: C7.2 Q1.1 45.29,14.73 IC5.13
XTAL2
  Bottom 1.016: C8.2 Q1.2 47.83,14.99 IC5.14
(copper drawn outside any net)
  shapes: Top area x791

### Text on the board
Top: EKG | C:/Users/YESSER-M/Documents/eagle/ECG/vinilo decorativo electrocardiograma.bmp
Bottom: EKG | 2016
tNames: + | - | D:/IMAGENES/UDP MICROCHIP.bmp